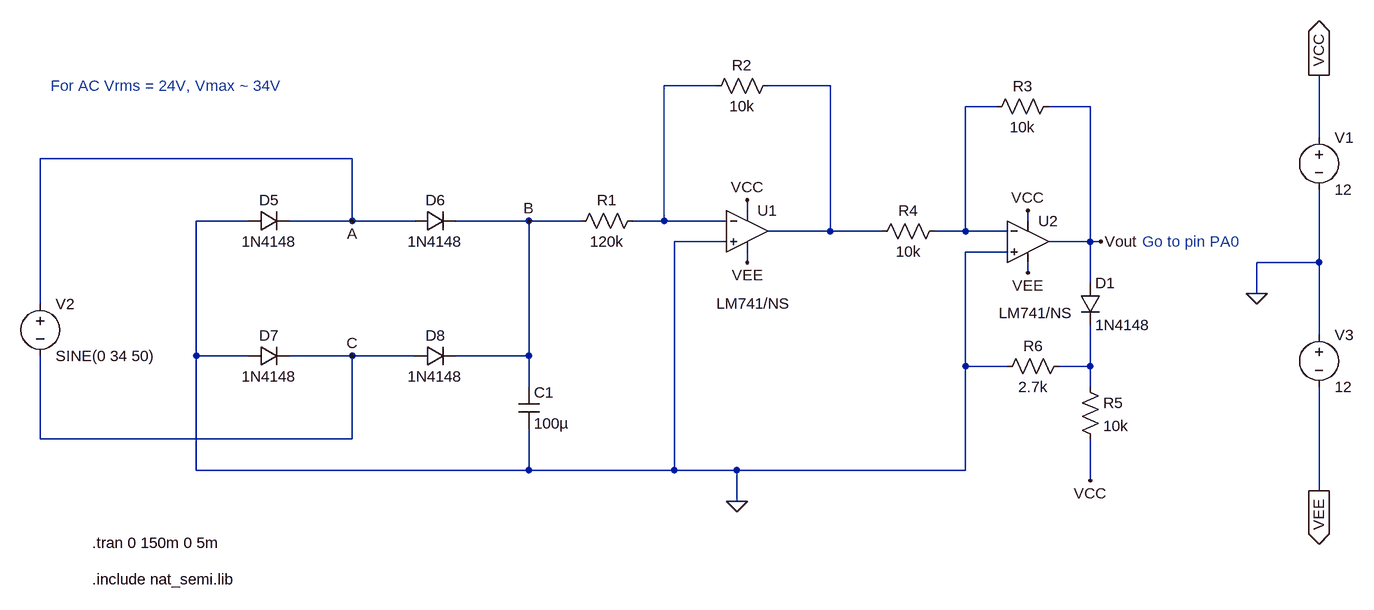
[diagram p0: schematic AC-DC converter.asc]
AC-DC converter.asc, the LTspice schematic file:
Version 4.1
SHEET 1 1688 680
WIRE 688 -992 608 -992
WIRE 864 -992 768 -992
WIRE 1120 -960 1072 -960
WIRE 1264 -960 1200 -960
WIRE 1616 -912 1616 -1008
WIRE 128 -880 -352 -880
WIRE 736 -800 736 -816
WIRE -32 -784 -112 -784
WIRE 128 -784 128 -880
WIRE 128 -784 32 -784
WIRE 224 -784 128 -784
WIRE 400 -784 288 -784
WIRE 480 -784 400 -784
WIRE 608 -784 608 -992
WIRE 608 -784 560 -784
WIRE 704 -784 608 -784
WIRE 1168 -784 1168 -800
WIRE 864 -768 864 -992
WIRE 864 -768 768 -768
WIRE 944 -768 864 -768
WIRE 1072 -768 1072 -960
WIRE 1072 -768 1024 -768
WIRE 1136 -768 1072 -768
WIRE 704 -752 624 -752
WIRE 1264 -752 1264 -960
WIRE 1264 -752 1200 -752
WIRE 1280 -752 1264 -752
WIRE 1136 -736 1072 -736
WIRE 736 -720 736 -736
WIRE 1616 -720 1616 -832
WIRE 1616 -720 1520 -720
WIRE 1168 -704 1168 -720
WIRE 1264 -688 1264 -752
WIRE 1520 -672 1520 -720
WIRE -352 -656 -352 -880
WIRE 1616 -608 1616 -720
WIRE -112 -576 -112 -784
WIRE -32 -576 -112 -576
WIRE 128 -576 32 -576
WIRE 224 -576 128 -576
WIRE 400 -576 400 -784
WIRE 400 -576 288 -576
WIRE 1072 -560 1072 -736
WIRE 1136 -560 1072 -560
WIRE 1264 -560 1264 -624
WIRE 1264 -560 1216 -560
WIRE 400 -528 400 -576
WIRE 1264 -528 1264 -560
WIRE -352 -448 -352 -576
WIRE 128 -448 128 -576
WIRE 128 -448 -352 -448
WIRE -112 -400 -112 -576
WIRE 400 -400 400 -464
WIRE 400 -400 -112 -400
WIRE 624 -400 624 -752
WIRE 624 -400 400 -400
WIRE 720 -400 624 -400
WIRE 1072 -400 1072 -560
WIRE 1072 -400 720 -400
WIRE 1264 -384 1264 -448
WIRE 1616 -368 1616 -528
WIRE 720 -352 720 -400
FLAG 128 -784 A
FLAG 400 -784 B
FLAG 720 -352 0
FLAG 128 -576 C
FLAG 1616 -1008 VCC
IOPIN 1616 -1008 Out
FLAG 1616 -368 VEE
IOPIN 1616 -368 Out
FLAG 1520 -672 0
FLAG 1280 -752 Vout
FLAG 736 -816 VCC
FLAG 1168 -800 VCC
FLAG 1168 -704 VEE
FLAG 736 -720 VEE
FLAG 1264 -384 VCC
SYMBOL cap 384 -528 R0
SYMATTR InstName C1
SYMATTR Value 100µ
SYMBOL diode -32 -768 R270
WINDOW 0 32 32 VTop 2
WINDOW 3 0 32 VBottom 2
SYMATTR InstName D5
SYMATTR Value 1N4148
SYMBOL diode 224 -768 R270
WINDOW 0 32 32 VTop 2
WINDOW 3 0 32 VBottom 2
SYMATTR InstName D6
SYMATTR Value 1N4148
SYMBOL diode -32 -560 R270
WINDOW 0 32 32 VTop 2
WINDOW 3 0 32 VBottom 2
SYMATTR InstName D7
SYMATTR Value 1N4148
SYMBOL diode 224 -560 R270
WINDOW 0 32 32 VTop 2
WINDOW 3 0 32 VBottom 2
SYMATTR InstName D8
SYMATTR Value 1N4148
SYMBOL voltage -352 -672 R0
WINDOW 123 0 0 Left 0
WINDOW 39 0 0 Left 0
SYMATTR InstName V2
SYMATTR Value SINE(0 34 50)
SYMBOL OpAmps\\opamp2 736 -832 R0
WINDOW 3 -47 175 Left 2
SYMATTR Value LM741/NS
SYMATTR InstName U1
SYMBOL OpAmps\\opamp2 1168 -816 R0
WINDOW 3 -45 174 Left 2
SYMATTR Value LM741/NS
SYMATTR InstName U2
SYMBOL voltage 1616 -928 R0
WINDOW 123 0 0 Left 0
WINDOW 39 0 0 Left 0
SYMATTR InstName V1
SYMATTR Value 12
SYMBOL voltage 1616 -624 R0
WINDOW 123 0 0 Left 0
WINDOW 39 0 0 Left 0
SYMATTR InstName V3
SYMATTR Value 12
SYMBOL res 576 -800 R90
WINDOW 0 0 56 VBottom 2
WINDOW 3 32 56 VTop 2
SYMATTR InstName R1
SYMATTR Value 120k
SYMBOL res 784 -1008 R90
WINDOW 0 0 56 VBottom 2
WINDOW 3 32 56 VTop 2
SYMATTR InstName R2
SYMATTR Value 10k
SYMBOL res 1216 -976 R90
WINDOW 0 0 56 VBottom 2
WINDOW 3 32 56 VTop 2
SYMATTR InstName R3
SYMATTR Value 10k
SYMBOL res 1040 -784 R90
WINDOW 0 0 56 VBottom 2
WINDOW 3 32 56 VTop 2
SYMATTR InstName R4
SYMATTR Value 10k
SYMBOL res 1248 -544 R0
SYMATTR InstName R5
SYMATTR Value 10k
SYMBOL res 1232 -576 R90
WINDOW 0 0 56 VBottom 2
WINDOW 3 32 56 VTop 2
SYMATTR InstName R6
SYMATTR Value 2.7k
SYMBOL diode 1248 -688 R0
SYMATTR InstName D1
SYMATTR Value 1N4148
TEXT -272 -232 Left 2 !.include nat_semi.lib
TEXT -272 -288 Left 2 !.tran 0 150m 0 5m
TEXT -336 -992 Left 2 ;For AC Vrms = 24V, Vmax ~ 34V
TEXT 1344 -752 Left 2 ;Go to pin PA0

The netlist it stands for:
* AC-DC converter.asc
C1 B 0 100µ
D5 0 A 1N4148
D6 A B 1N4148
D7 0 C 1N4148
D8 C B 1N4148
V2 A C SINE(0 34 50)
X§U1 0 N001 VCC VEE N002 LM741/NS  ; pins In+ In- V+ V- OUT
X§U2 0 N003 VCC VEE Vout LM741/NS  ; pins In+ In- V+ V- OUT
V1 VCC 0 12
V3 0 VEE 12
R1 N001 B 120k
R2 N002 N001 10k
R3 Vout N003 10k
R4 N003 N002 10k
R5 N004 VCC 10k
R6 N004 0 2.7k
D1 Vout N004 1N4148
.model D D
.lib standard.dio
.include nat_semi.lib
.tran 0 150m 0 5m
* For AC Vrms = 24V, Vmax ~ 34V
* Go to pin PA0
.backanno
.end